# Altium schematic sheet 0-10V_Converter.SchDoc
size A; SheetNumber: 2; SheetTotal: 3
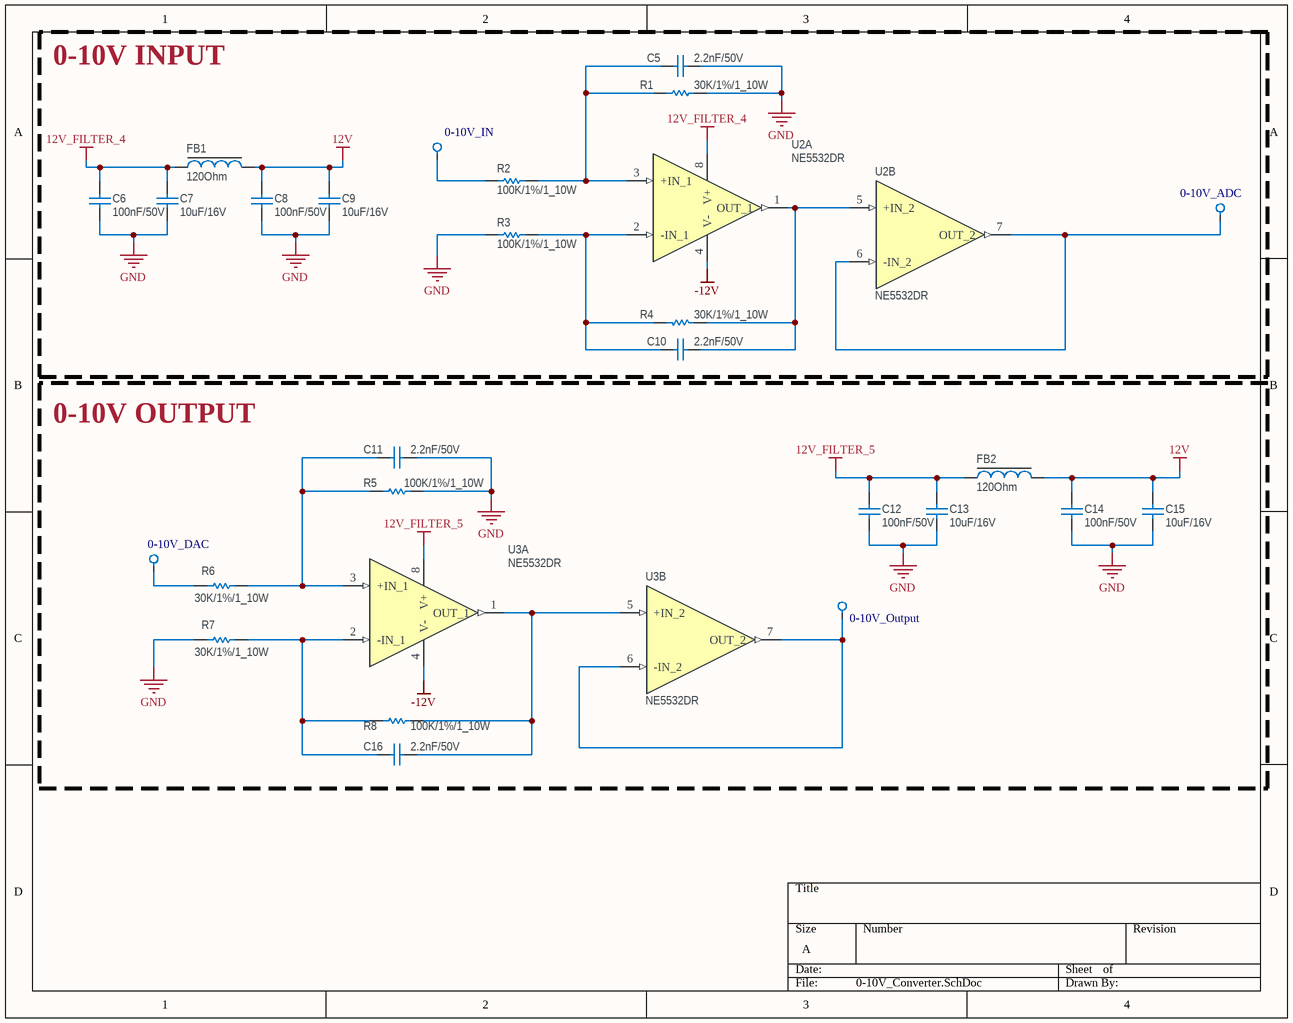
[diagram p0: 0-10V_Converter.SchDoc]

## Parts
0-10V_ADC  0-10V_ADC  [TestPoint_THTPad_D1.5mm_Drill0.7mm]  (value not drawn)
0-10V_DAC  0-10V_DAC  [TestPoint_THTPad_D1.5mm_Drill0.7mm]  (value not drawn)
0-10V_IN  0-10V_IN  [TestPoint_THTPad_D1.5mm_Drill0.7mm]  (value not drawn)
0-10V_Output  0-10V_Output  [TestPoint_THTPad_D1.5mm_Drill0.7mm]  (value not drawn)
C5  2.2nF/50V  [CAP_0603]
C6  100nF/50V  [CAP_0603]
C7  10uF/16V  [CAP_0603]
C8  100nF/50V  [CAP_0603]
C9  10uF/16V  [CAP_0603]
C10  2.2nF/50V  [CAP_0603]
C11  2.2nF/50V  [CAP_0603]
C12  100nF/50V  [CAP_0603]
C13  10uF/16V  [CAP_0603]
C14  100nF/50V  [CAP_0603]
C15  10uF/16V  [CAP_0603]
C16  2.2nF/50V  [CAP_0603]
FB1  120Ohm  [Ferrite_Bead_0805]
FB2  120Ohm  [Ferrite_Bead_0805]
R1  30K/1%/1_10W  [Resistor_0603]
R2  100K/1%/1_10W  [Resistor_0603]
R3  100K/1%/1_10W  [Resistor_0603]
R4  30K/1%/1_10W  [Resistor_0603]
R5  100K/1%/1_10W  [Resistor_0603]
R6  30K/1%/1_10W  [Resistor_0603]
R7  30K/1%/1_10W  [Resistor_0603]
R8  100K/1%/1_10W  [Resistor_0603]
U2  NE5532DR  [SOIC-8]  (parts A,B of 2)
U3  NE5532DR  [SOIC-8]  (parts A,B of 2)

## Blocks framed on the sheet
0-10V INPUT: 0-10V_ADC 0-10V_IN C5-C10 FB1 R1-R4 U2
0-10V OUTPUT: 0-10V_DAC 0-10V_Output C11-C16 FB2 R5-R8 U3

## Nets
12V: C8.2 C9.2 C14.2 C15.2 FB1.2 FB2.2
12V_FILTER_4: C6.2 C7.2 FB1.1 U2.8(V+)
12V_FILTER_5: C12.2 C13.2 FB2.1 U3.8(V+)
-12V: U2.4(V-) U3.4(V-)
GND: C5.2 C6.1 C7.1 C8.1 C9.1 C11.2 C12.1 C13.1 C14.1 C15.1 R1.2 R3.1 R5.2 R7.1
Net0-10V_ADC_1: 0-10V_ADC.1 U2.6(-IN_2) U2.7(OUT_2)
Net0-10V_DAC_1: 0-10V_DAC.1 R6.1
Net0-10V_IN_1: 0-10V_IN.1 R2.1
Net0-10V_Output_1: 0-10V_Output.1 U3.6(-IN_2) U3.7(OUT_2)
NetC5_1: C5.1 R1.1 R2.2 U2.3(+IN_1)
NetC10_1: C10.1 R3.2 R4.1 U2.2(-IN_1)
NetC10_2: C10.2 R4.2 U2.1(OUT_1) U2.5(+IN_2)
NetC11_1: C11.1 R5.1 R6.2 U3.3(+IN_1)
NetC16_1: C16.1 R7.2 R8.1 U3.2(-IN_1)
NetC16_2: C16.2 R8.2 U3.1(OUT_1) U3.5(+IN_2)

## Library data of the parts
0-10V_ADC 0-10V_DAC 0-10V_IN 0-10V_Output = Testpoint_TH: Test Point TEST-1BK; Supply Name: BanLinhKien; Datasheet: *; Supply Part Number: Test Point TEST-1BK; Supply URL: https://banlinhkien.com/test-point-test1bk-mau-den-5c-p18255999.html
C5 C10 C11 C16 = Ceramic_Cap_2.2nF_50V_0603: CAP, size 0603, 2.2nF, 50V; Supply Part Number: CC0603KRX7R9BB222; Supply Name: tme; Datasheet: *; Supply URL: http://www.tme.vn/Product.aspx?id=1310#page=pro_info
C6 C8 C12 C14 = Ceramic_Cap_100nF_50V_0603: CAP, size 0603, 100nF, 50V; Supply Part Number: Tụ Gốm 0603 100nF (0.1uF) 50V; Supply Name: Thegioiic; Datasheet: *; Supply URL: https://www.thegioiic.com/tu-gom-0603-100nf-0-1uf-50v
C7 C9 C13 C15 = Ceramic_Cap_10uF_16V_0603: CAP, size 0603, 10uF, 16V; Supply Part Number: Tụ Gốm 0603 10uF 16V; Supply Name: Thegioiic; Datasheet: *; Supply URL: https://www.thegioiic.com/tu-gom-0603-10uf-16v
FB1 FB2 = Ferrite_Bead_120Ohm_2A_0805: Ferrite Bead, size 0805, 120Ohm, 2A; Supply Part Number: CBW201209U121T Ferrite Beads 2A 120 Ohm 0805; Supply Name: Thegioiic; Supply URL: https://www.thegioiic.com/cbw201209u121t-ferrite-beads-2a-120-ohm-0805
R1 R4 R6 R7 = Res_30K_0603_1%: Resistor 0603 30KOhm 1% 1_10W; Supply Part Number: Điện Trở 30 KOhm 0603 1%; Supply Name: LinhkienX; Supply URL: https://linhkienx.com/vi/dien-tro-30-kohm-0603-1-
R2 R3 R5 R8 = Res_100K_0603_1%: Resistor 0603 100KOhm 1% 1_10W; Supply Part Number: Điện Trở 100 KOhm 0603 1%; Supply Name: Thegioiic; Supply URL: https://www.thegioiic.com/dien-tro-100-kohm-0603-1-
U2 U3 = NE5532DR: Low Noise Single/Dual Operational Amplifier - SOIC-8; Supply Name: tme; Datasheet: https://www.ti.com/lit/ds/symlink/ne5532.pdf; Supply Part Number: NE5532DR; Supply URL: http://www.tme.vn/Product.aspx?id=2122#page=pro_info